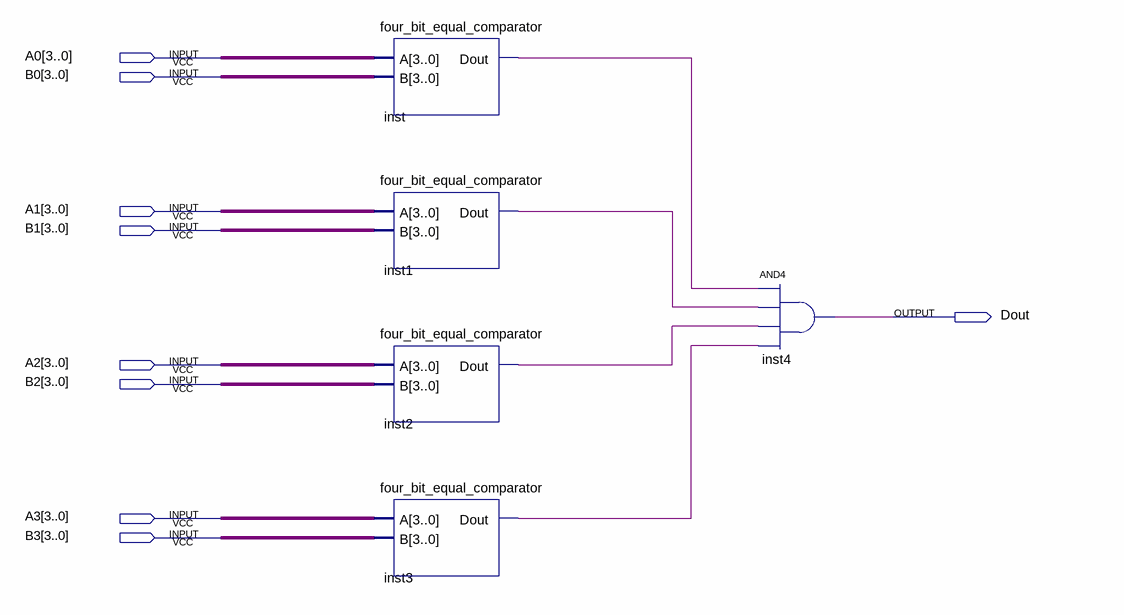
[diagram p0: schematic sheet]
// Quartus schematic number_comparator.bdf as structural Verilog: 5 symbols, 9 pins
module number_comparator (
  input  [3:0] A0,
  input  [3:0] B0,
  input  [3:0] A1,
  input  [3:0] B1,
  input  [3:0] A2,
  input  [3:0] B2,
  input  [3:0] A3,
  input  [3:0] B3,
  output Dout
);

  wire inst1_dout, inst2_dout, inst3_dout, inst_dout;

  four_bit_equal_comparator inst (.A(A0), .B(B0), .Dout(inst_dout));
  four_bit_equal_comparator inst1 (.A(A1), .B(B1), .Dout(inst1_dout));
  four_bit_equal_comparator inst2 (.A(A2), .B(B2), .Dout(inst2_dout));
  four_bit_equal_comparator inst3 (.A(A3), .B(B3), .Dout(inst3_dout));
  and inst4 (Dout, inst_dout, inst1_dout, inst2_dout, inst3_dout);
endmodule
